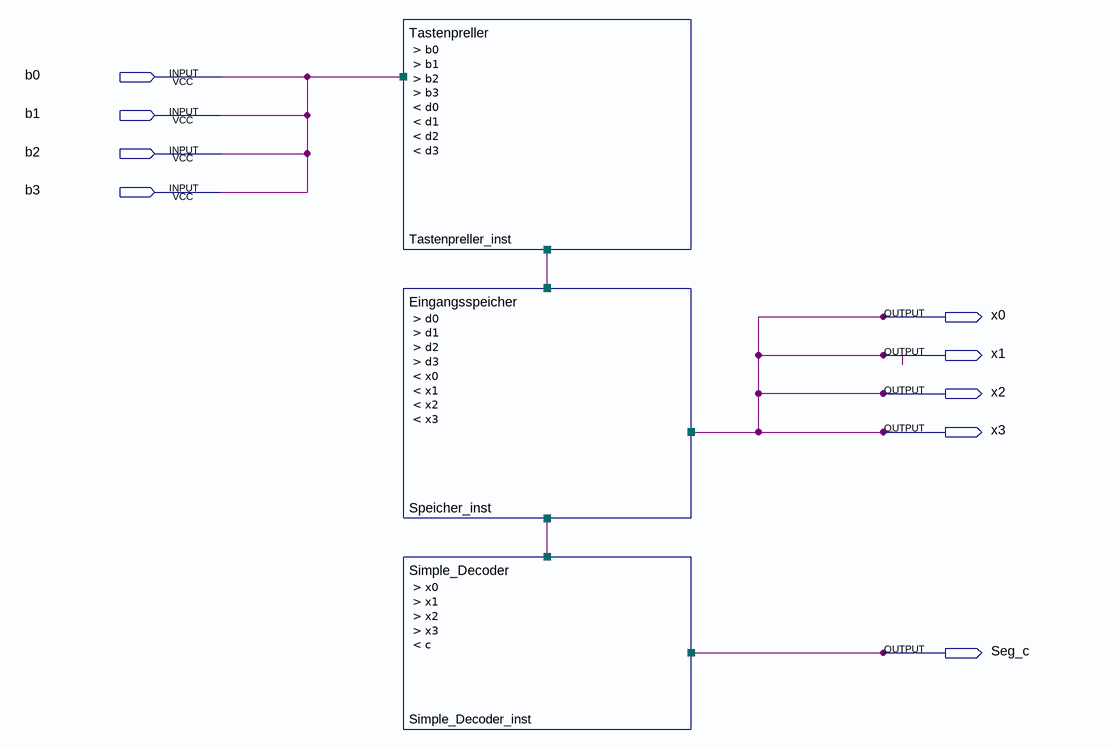
[diagram p0: schematic sheet]
// Quartus schematic Lab_1_DT.bdf as structural Verilog: 3 symbols, 9 pins
module Lab_1_DT (
  input  b0,
  input  b1,
  input  b2,
  input  b3,
  output x0,
  output x1,
  output x2,
  output x3,
  output Seg_c
);

  wire d0, d1, d2, d3;

  Tastenpreller Tastenpreller_inst (.b0(b0), .d0(d0), .d1(d1), .d2(d2), .d3(d3));  // open: b1, b2, b3
  Eingangsspeicher Speicher_inst (.d0(d0), .d1(d1), .d2(d2), .d3(d3), .x0(x0), .x1(x0), .x2(x0), .x3(x0));
  Simple_Decoder Simple_Decoder_inst (.x0(x0), .x1(x0), .x2(x0), .x3(x0));  // open: c

  assign b1 = b0;
  assign b2 = b0;
  assign b3 = b0;
  assign x1 = x0;
  assign x2 = x0;
  assign x3 = x0;
endmodule
